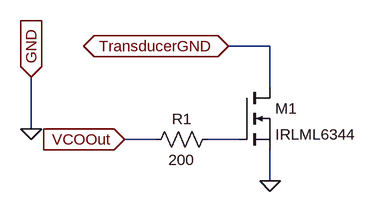
[diagram p0: schematic TransmissionAmp.asc]
TransmissionAmp.asc, the LTspice schematic file:
Version 4
SHEET 1 880 680
WIRE 304 96 240 96
WIRE 304 160 304 96
WIRE -64 224 -64 144
WIRE 128 240 80 240
WIRE 256 240 208 240
WIRE 304 304 304 256
FLAG -64 224 0
FLAG -64 144 GND
IOPIN -64 144 In
FLAG 240 96 TransducerGND
IOPIN 240 96 BiDir
FLAG 304 304 0
FLAG 80 240 VCOOut
IOPIN 80 240 In
SYMBOL nmos 256 160 R0
SYMATTR InstName M1
SYMATTR Value IRLML6344
SYMBOL res 224 224 R90
WINDOW 0 0 56 VBottom 2
WINDOW 3 32 56 VTop 2
SYMATTR InstName R1
SYMATTR Value 200

The netlist it stands for:
* TransmissionAmp.asc
M1 TransducerGND N001 0 0 IRLML6344
R1 N001 VCOOut 200
.model NMOS NMOS
.model PMOS PMOS
.lib standard.mos
.backanno
.end